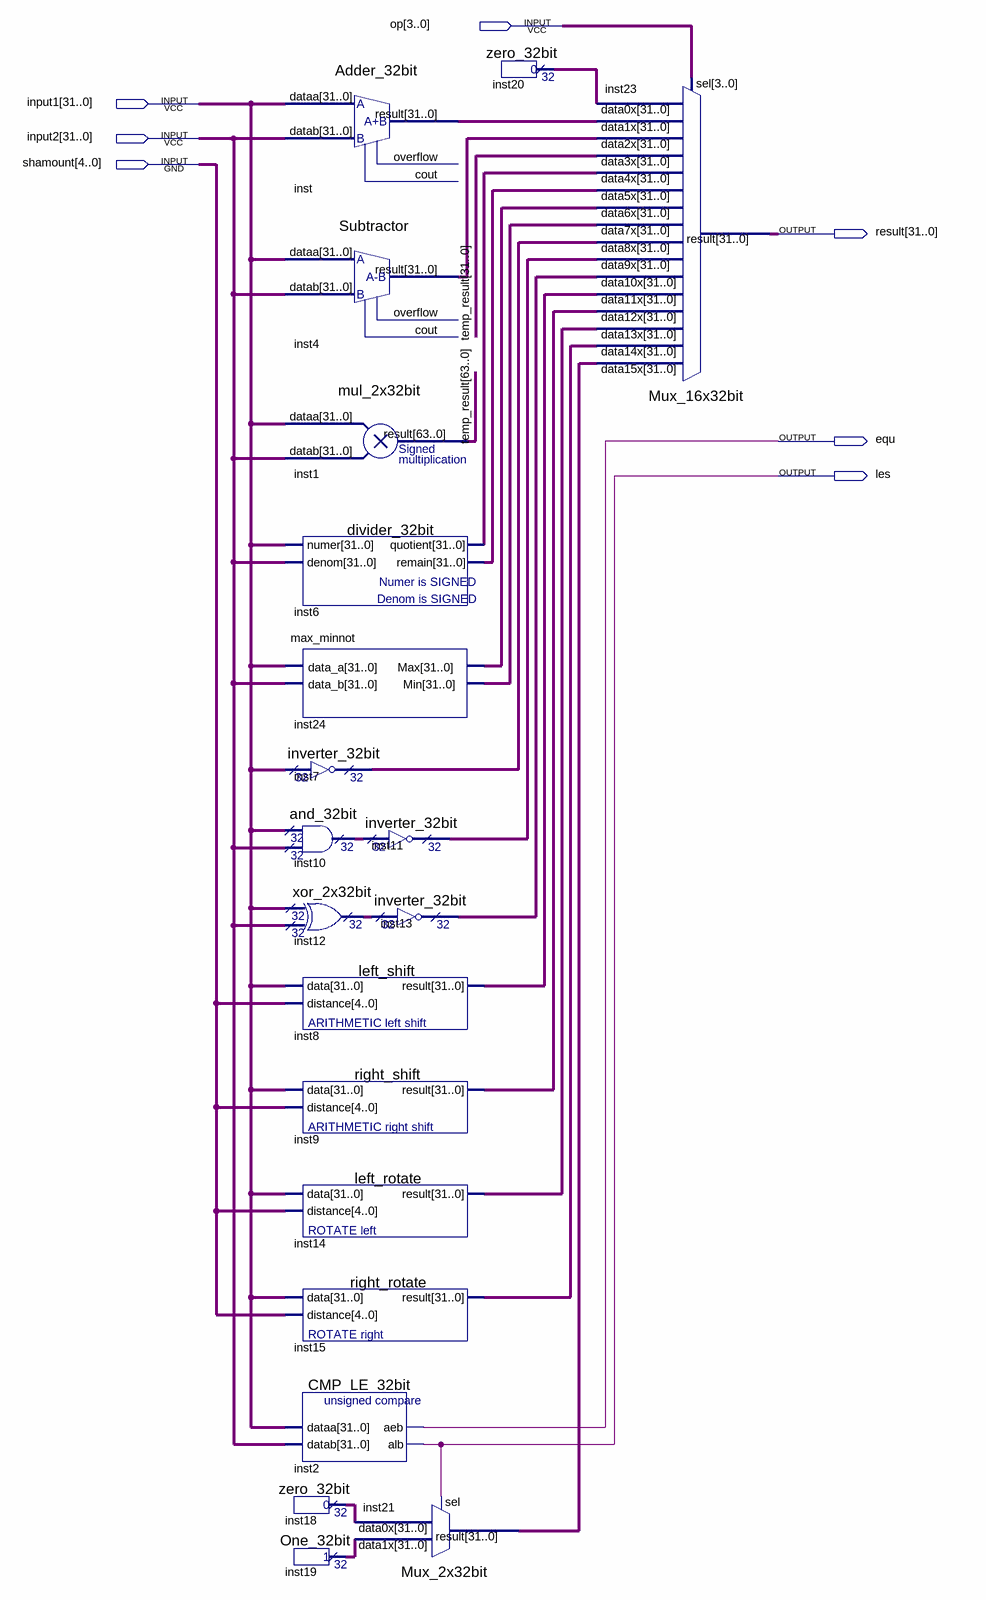
[diagram p0: schematic sheet]
// Quartus schematic ALU.bdf as structural Verilog: 20 symbols, 7 pins
module ALU (
  input  [3:0] op,
  input  [31:0] input1,
  input  [31:0] input2,
  input  [4:0] shamount,
  output [31:0] result,
  output equ,
  output les
);

  wire [31:0] inst4_result, inst6_quotient, inst6_remain, inst7_result, inst8_result, inst9_result,
       inst10_result, inst11_result, inst12_result, inst13_result, inst14_result, inst15_result,
       inst18_result, inst19_result, inst20_result, inst21_result, inst24_max, inst24_min, inst_result;
  wire [63:0] temp_result;

  Adder_32bit inst (.dataa(input1), .datab(input2), .result(inst_result));  // open: overflow, cout
  Subtractor inst4 (.dataa(input1), .datab(input2), .result(inst4_result));  // open: overflow, cout
  mul_2x32bit inst1 (.dataa(input1), .datab(input2), .result(temp_result));
  divider_32bit inst6 (.numer(input1), .denom(input2), .quotient(inst6_quotient), .remain(inst6_remain));
  max_minnot inst24 (.data_a(input1), .data_b(input2), .Max(inst24_max), .Min(inst24_min));
  inverter_32bit inst7 (.data(input1), .result(inst7_result));
  and_32bit inst10 (.data0x(input1), .data1x(input2), .result(inst10_result));
  xor_2x32bit inst12 (.data0x(input1), .data1x(input2), .result(inst12_result));
  left_shift inst8 (.data(input1), .distance(shamount), .result(inst8_result));
  right_shift inst9 (.data(input1), .distance(shamount), .result(inst9_result));
  left_rotate inst14 (.data(input1), .distance(shamount), .result(inst14_result));
  right_rotate inst15 (.data(input1), .distance(shamount), .result(inst15_result));
  CMP_LE_32bit inst2 (.dataa(input1), .datab(input2), .aeb(equ), .alb(les));
  zero_32bit inst18 (.result(inst18_result));
  One_32bit inst19 (.result(inst19_result));
  inverter_32bit inst11 (.data(inst10_result), .result(inst11_result));
  inverter_32bit inst13 (.data(inst12_result), .result(inst13_result));
  Mux_2x32bit inst21 (.data1x(inst19_result), .data0x(inst18_result), .sel(les), .result(inst21_result));
  zero_32bit inst20 (.result(inst20_result));
  Mux_16x32bit inst23 (
    .data15x(inst21_result), .data14x(inst15_result), .data13x(inst14_result), .data12x(inst9_result),
    .data11x(inst8_result), .data10x(inst13_result), .data9x(inst11_result), .data8x(inst7_result),
    .data7x(inst24_min), .data6x(inst24_max), .data5x(inst6_remain), .data4x(inst6_quotient),
    .data3x(temp_result[31:0]), .data2x(inst4_result), .data1x(inst_result), .data0x(inst20_result),
    .sel(op), .result(result));
endmodule
